# Altium project PCB_Project3.PrjPCB
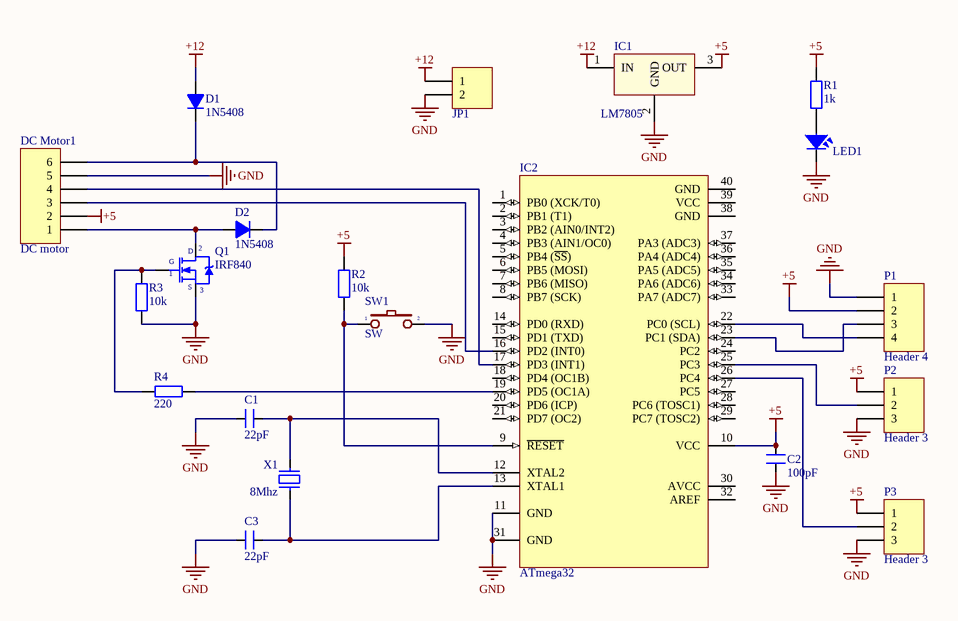
[diagram p0: Sheet1.SchDoc]
1 sheet, 20 parts. Net scope: global (net labels, ports and power ports of the same name join across sheets).
Board file: PCB2.PcbDoc

## Sheet Sheet1.SchDoc
size B

### Parts
C1  22pF  [CN1]
C2  100pF  [CN1]
C3  22pF  [CN1]
D1  1N5408  [D5A]
D2  1N5408  [D5A]
DC_Motor1  DC motor  [HDR1X6]
IC1  LM7805  [QTO-220]
IC2  ATmega32  [DIP40/W0.6]
JP1  Header 2_1  [HED2]  (value not drawn)
LED1  LED  [LED-3]  (value not drawn)
P1  Header 4  [HDR1X4]
P2  Header 3  [HDR1X3]
P3  Header 3  [HDR1X3]
Q1  IRF840  [QTO-220]
R1  1k  [R1/4W]
R2  10k  [R1/4W]
R3  10k  [R1/4W]
R4  220  [R1/4W]
SW1  SW  [SW2]
X1  8Mhz  [XT2]

### Nets
+5: C2.2 DC_Motor1.2 IC1.3(OUT) IC2.10(VCC) P1.2 P2.1 P3.1 R1.2 R2.2
+12: D1.1(A) IC1.1(IN) JP1.1
GND: C1.1 C2.1 C3.1 DC_Motor1.5 IC1.2(GND) IC2.11(GND) IC2.31(GND) JP1.2 LED1.2 P1.1 P2.3 P3.3 Q1.3(S) R3.1 SW1.2
NetC1_2: C1.2 IC2.12(XTAL2) X1.1
NetC3_2: C3.2 IC2.13(XTAL1) X1.2
NetD1_2: D1.2(K) D2.2(K) DC_Motor1.6
NetD2_1: D2.1(A) DC_Motor1.1 Q1.2(D)
NetDC_Motor1_3: DC_Motor1.3 IC2.16(PD2_(INT0))
NetDC_Motor1_4: DC_Motor1.4 IC2.17(PD3_(INT1))
NetIC2_9: IC2.9(~{RESET}) R2.1 SW1.1
NetIC2_19: IC2.19(PD5_(OC1A)) R4.2
NetIC2_22: IC2.22(PC0_(SCL)) P1.4
NetIC2_23: IC2.23(PC1_(SDA)) P1.3
NetIC2_25: IC2.25(PC3) P2.2
NetIC2_26: IC2.26(PC4) P3.2
NetLED1_1: LED1.1 R1.1
NetQ1_1: Q1.1(G) R3.2 R4.1

Not connected (* = marked no-connect by the designer): IC2 1(PB0_(XCK/T0)) 2(PB1_(T1)) 3(PB2_(AIN0/INT2)) 4(PB3_(AIN1/OC0)) 5(PB4_(~{SS})) 6(PB5_(MOSI)) 7(PB6_(MISO)) 8(PB7_(SCK)) 14(PD0_(RXD)) 15(PD1_(TXD)) 18(PD4_(OC1B)) 20(PD6_(ICP)) 21(PD7_(OC2)) 24(PC2) 27(PC5) 28(PC6_(TOSC1)) 29(PC7_(TOSC2)) 30(AVCC) 32(AREF) 33(PA7_(ADC7)) 34(PA6_(ADC6)) 35(PA5_(ADC5)) 36(PA4_(ADC4)) 37(PA3_(ADC3)) 38(GND) 39(VCC) 40(GND)

### Library data of the parts
C1 C3 = CN1: Cap np  1pF - 472pF; Value: 100pF
C2 = CN1: Cap np  1pF - 472pF; Value: 100pF
D1 D2 = D5A: Diode 5A; Value: 1N5408
DC_Motor1 = Header 6: Header, 6-Pin; LatestRevisionDate: 17-Jul-2002; LatestRevisionNote: Re-released for DXP Platform.; Publisher: Altium Limited
IC1 = LM78xx: On ap +, from + 5 to + 24VDC; Value: LM7805
IC2 = ATmega8535: 8-Bit AVR Microcontroller with 8K Bytes of In-System Programmable Flash Memory
JP1 = Header 2_1: Header, 2-Pin; Manufacturer: Generic Components; Class: Connector; Value: Header 2
LED1 = LED: LED Single colour Green and Red; Value: LED 3 ly Single Colour
P1 = Header 4: Header, 4-Pin; LatestRevisionDate: 17-Jul-2002; LatestRevisionNote: Re-released for DXP Platform.; Publisher: Altium Limited
P2 P3 = Header 3: Header, 3-Pin; LatestRevisionDate: 17-Jul-2002; LatestRevisionNote: Re-released for DXP Platform.; Publisher: Altium Limited
Q1 = IRF840: MOSFET N - CHANNEL 500V - 0.75 - 8A - TO-220; Value: IRF840
R1-R4 = R1/4W: Resistor 1/4W; Value: R1/4W - 1K
SW1 = SW2: Switch button 2 pin; Value: SW chip 2 pin
X1 = XT2: Crystal For all Crystal 2pin.; Value: 4Mhz